# EAGLE design MIDIWidgetRevB (EAGLE 6.5.0)
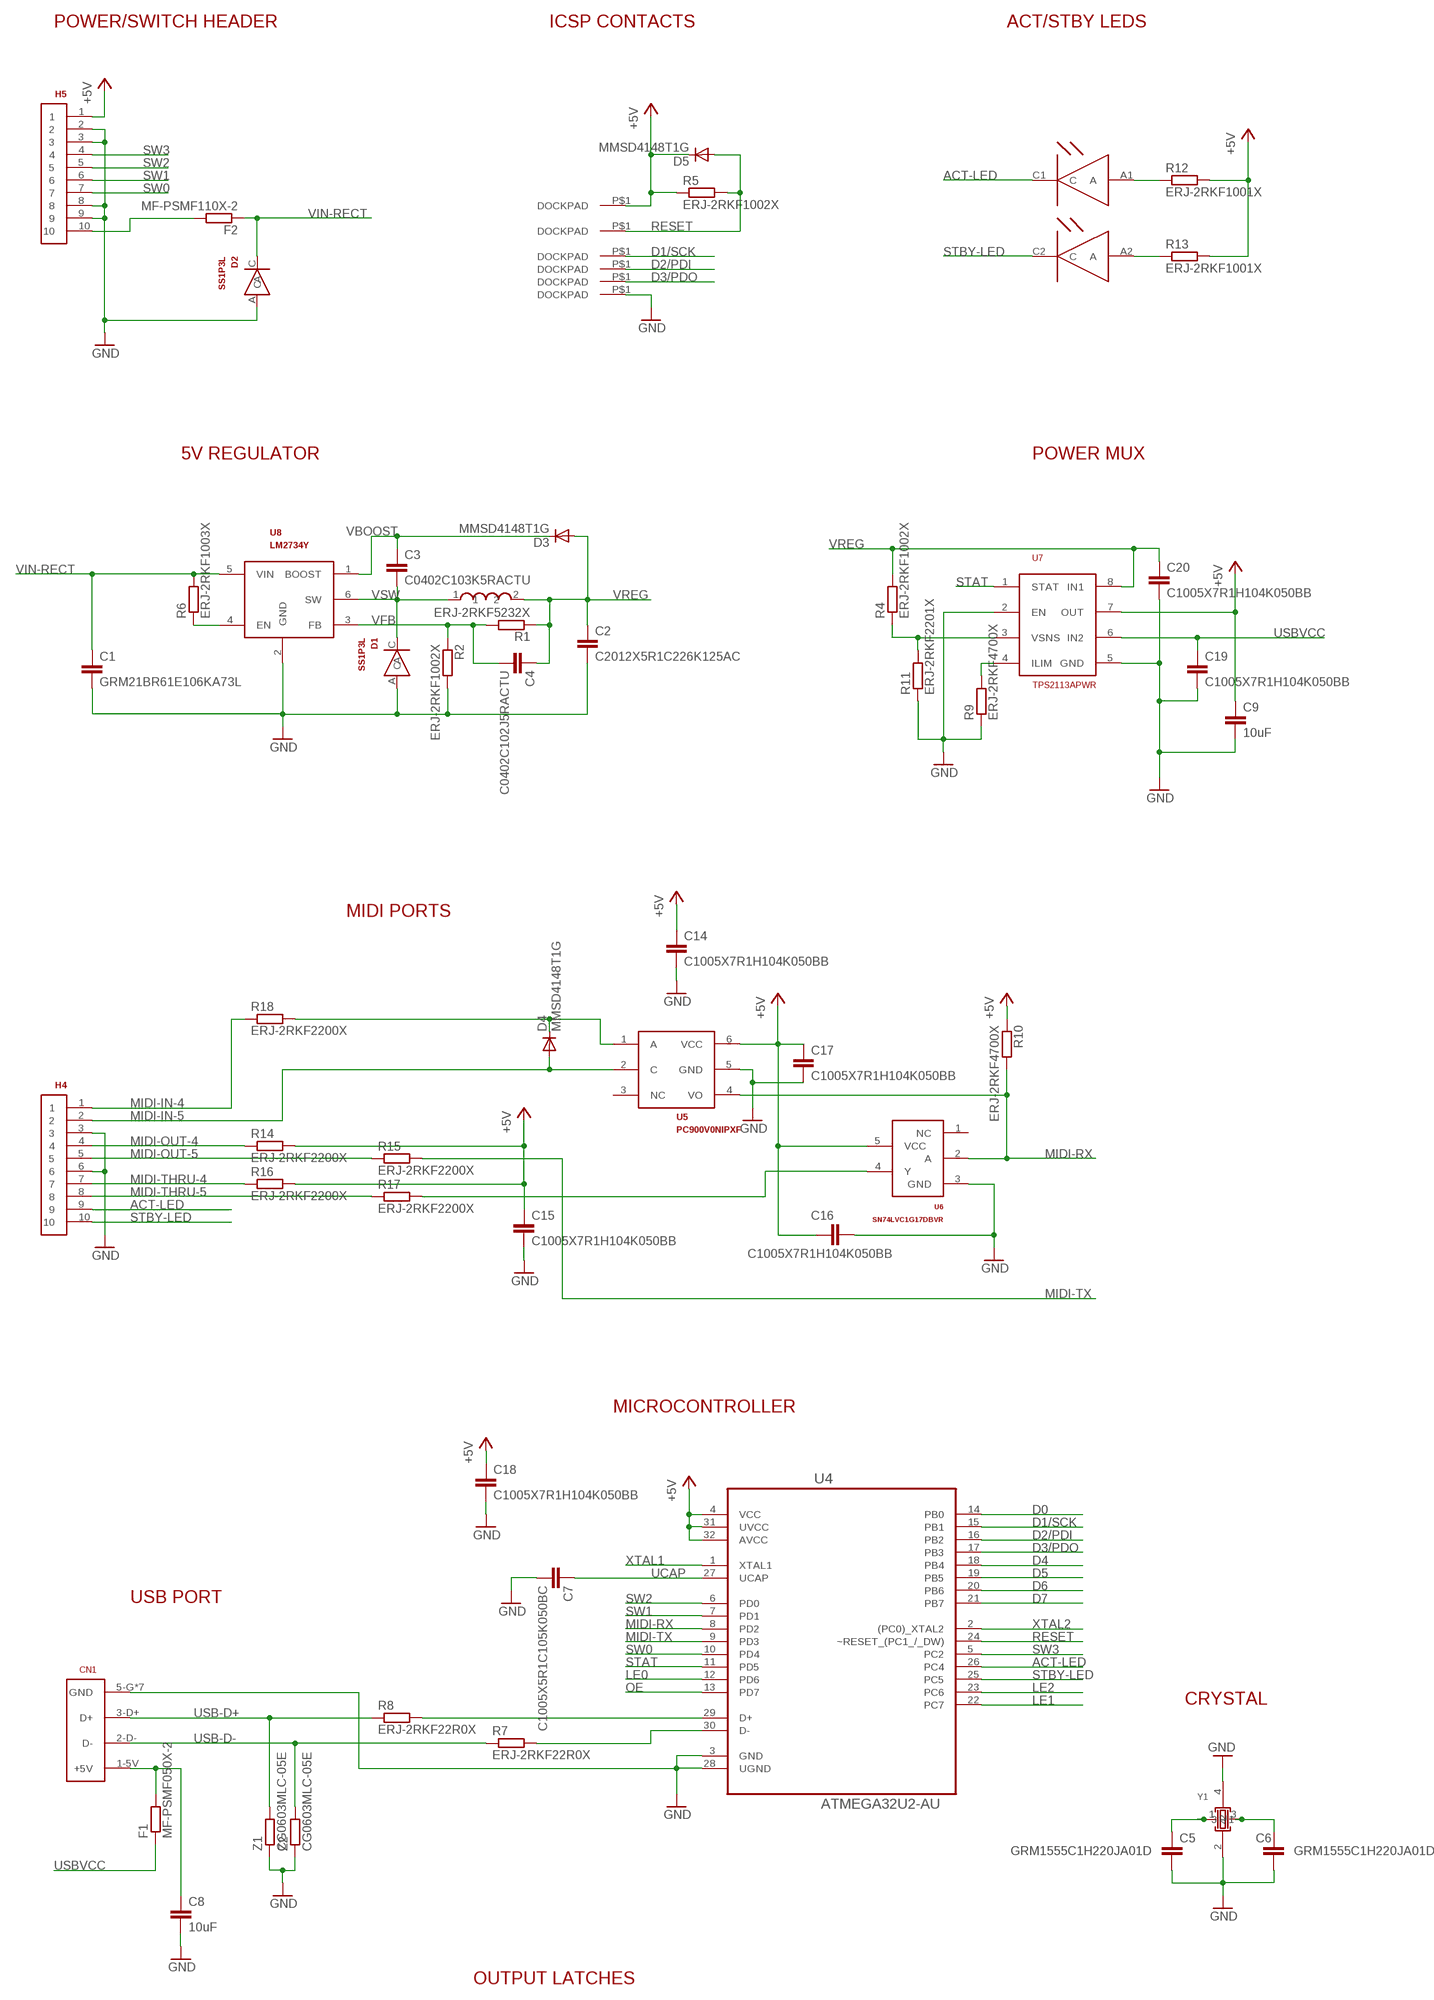
[diagram p0: schematic, sheet 1, part 1 of 2]
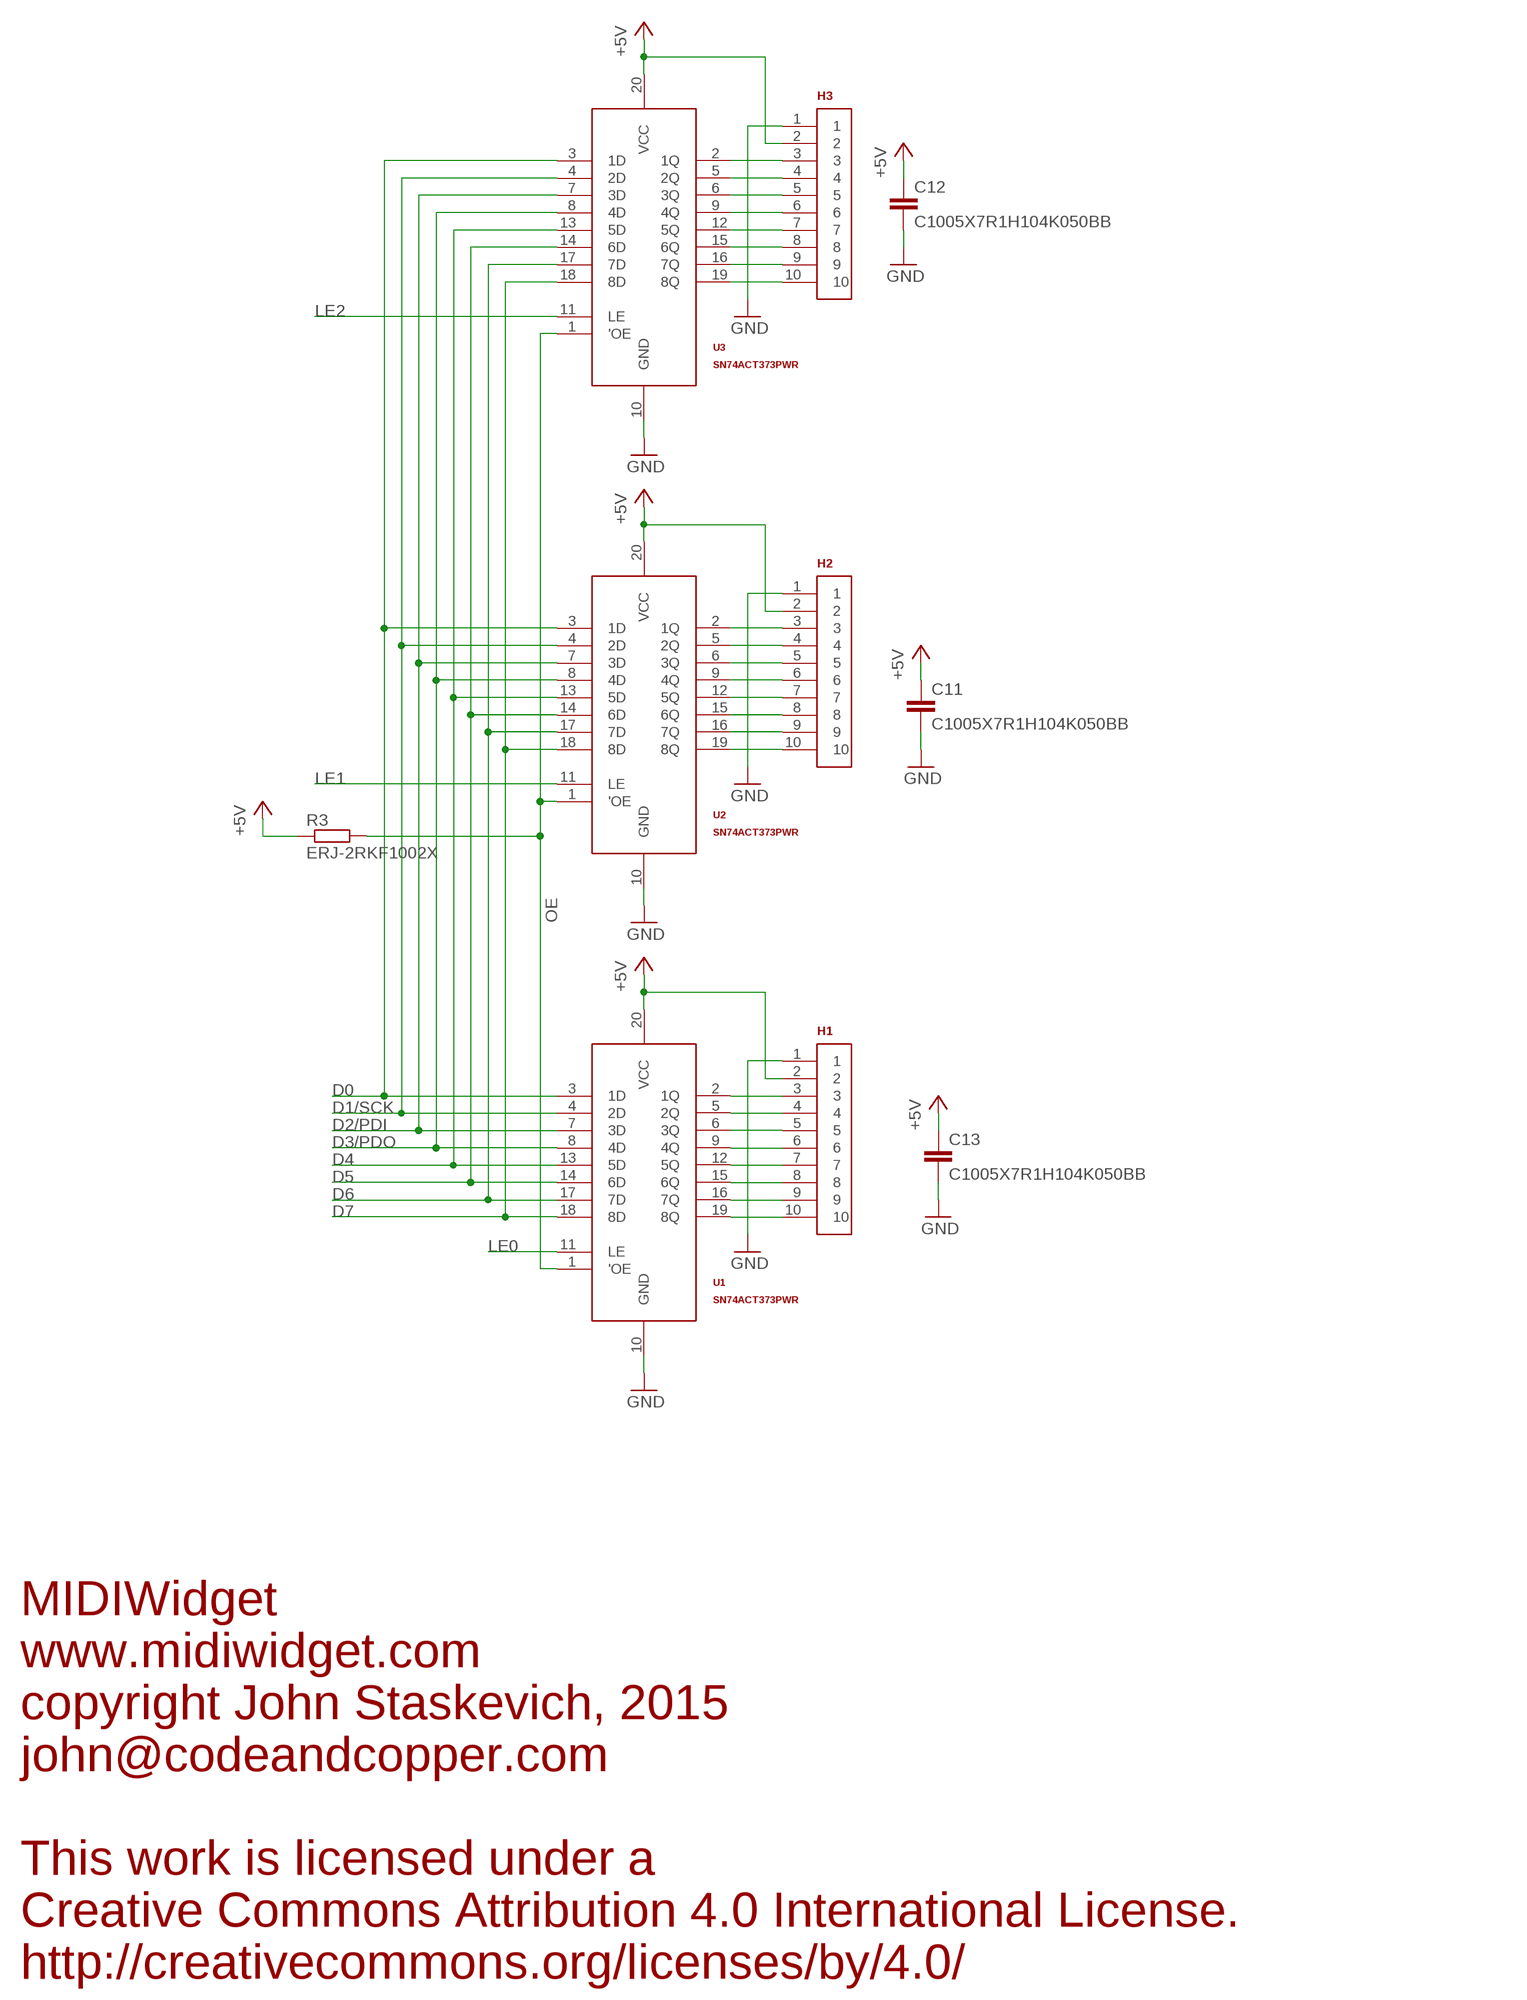
[diagram p1: schematic, sheet 1, part 2 of 2]

## Parts
C1  GRM21BR61E106KA73L  C-EUC0805  [C0805]
C2  C2012X5R1C226K125AC  C-EUC0805  [C0805]
C3  C0402C103K5RACTU  C-EUC0402  [C0402]
C4  C0402C102J5RACTU  C-EUC0402  [C0402]
C5  GRM1555C1H220JA01D  C-EUC0402  [C0402]
C6  GRM1555C1H220JA01D  C-EUC0402  [C0402]
C7  C1005X5R1C105K050BC  C-EUC0402  [C0402]
C8  10uF  C-EUC0805  [C0805]
C9  10uF  C-EUC0805  [C0805]
C11  C1005X7R1H104K050BB  C-EUC0402  [C0402]
C12  C1005X7R1H104K050BB  C-EUC0402  [C0402]
C13  C1005X7R1H104K050BB  C-EUC0402  [C0402]
C14  C1005X7R1H104K050BB  C-EUC0402  [C0402]
C15  C1005X7R1H104K050BB  C-EUC0402  [C0402]
C16  C1005X7R1H104K050BB  C-EUC0402  [C0402]
C17  C1005X7R1H104K050BB  C-EUC0402  [C0402]
C18  C1005X7R1H104K050BB  C-EUC0402  [C0402]
C19  C1005X7R1H104K050BB  C-EUC0402  [C0402]
C20  C1005X7R1H104K050BB  C-EUC0402  [C0402]
CN1  10118192-0001LF  USB-B  [USB-MICRO-B]
D1  SS1P3L  DIODE  [DO-220AA(SMP)]
D2  SS1P3L  DIODE  [DO-220AA(SMP)]
D3  MMSD4148T1G  1N4148SOD123  [SOD123]
D4  MMSD4148T1G  1N4148SOD123  [SOD123]
D5  MMSD4148T1G  1N4148SOD123  [SOD123]
DOCK-GND  DOCKPAD  [DOCKPAD-ROUND-2.0MM]
DOCK-PDI  DOCKPAD  [DOCKPAD-ROUND-2.0MM]
DOCK-PDO  DOCKPAD  [DOCKPAD-ROUND-2.0MM]
DOCK-RESET  DOCKPAD  [DOCKPAD-ROUND-2.0MM]
DOCK-SCK  DOCKPAD  [DOCKPAD-ROUND-2.0MM]
DOCK-VCC  DOCKPAD  [DOCKPAD-ROUND-2.0MM]
F1  MF-PSMF050X-2  R-EU_R0805  [R0805]
F2  MF-PSMF110X-2  R-EU_R0805  [R0805]
H1  TERMINAL-BLOCK-10POS  [TB-2-54-10POS]
H2  TERMINAL-BLOCK-10POS  [TB-2-54-10POS]
H3  TERMINAL-BLOCK-10POS  [TB-2-54-10POS]
H4  TERMINAL-BLOCK-10POS  [TB-2-54-10POS]
H5  TERMINAL-BLOCK-10POS  [TB-2-54-10POS]
L1  SLF7055T-220M1R7-3PF  INDUCTOR-SMT  [SLF7055]
LED  HSMF-C155  DUAL-LED  [LUMEX-1210-DUAL-LED]
R1  ERJ-2RKF5232X  R-EU_R0402  [R0402]
R2  ERJ-2RKF1002X  R-EU_R0402  [R0402]
R3  ERJ-2RKF1002X  R-EU_R0402  [R0402]
R4  ERJ-2RKF1002X  R-EU_R0402  [R0402]
R5  ERJ-2RKF1002X  R-EU_R0402  [R0402]
R6  ERJ-2RKF1003X  R-EU_R0402  [R0402]
R7  ERJ-2RKF22R0X  R-EU_R0402  [R0402]
R8  ERJ-2RKF22R0X  R-EU_R0402  [R0402]
R9  ERJ-2RKF4700X  R-EU_R0402  [R0402]
R10  ERJ-2RKF4700X  R-EU_R0402  [R0402]
R11  ERJ-2RKF2201X  R-EU_R0402  [R0402]
R12  ERJ-2RKF1001X  R-EU_R0402  [R0402]
R13  ERJ-2RKF1001X  R-EU_R0402  [R0402]
R14  ERJ-2RKF2200X  R-EU_R0402  [R0402]
R15  ERJ-2RKF2200X  R-EU_R0402  [R0402]
R16  ERJ-2RKF2200X  R-EU_R0402  [R0402]
R17  ERJ-2RKF2200X  R-EU_R0402  [R0402]
R18  ERJ-2RKF2200X  R-EU_R0402  [R0402]
U1  SN74ACT373PWR  74ABT373  [TSSOP-20]
U2  SN74ACT373PWR  74ABT373  [TSSOP-20]
U3  SN74ACT373PWR  74ABT373  [TSSOP-20]
U4  ATMEGA32U2-AU  [QFP80P900X900X120-32N]
U5  PC900V0NIPXF  PC900V  [SMT-6]
U6  SN74LVC1G17DBVR  SN74LVC1G17  [SOT23-5-GOOD]
U7  TPS2113APWR  TPS2112NAKED  [TSSOP-8-NAKED]
U8  LM2734Y  LM2734  [TSOT-6]
Y1  403C35E16M00000  CTS-403-CRYSTAL  [CRYSTAL-32-25MM]
Z1  CG0603MLC-05E  R-EU_R0603  [R0603]
Z2  CG0603MLC-05E  R-EU_R0603  [R0603]

## Nets
+5V [power]: C9.1 C11.1 C12.1 C13.1 C14.1 C15.1 C16.1 C17.1 C18.1 D5.C DOCK-VCC.P$1(DOCKPAD) H1.2 H2.2 H3.2 H5.1 R3.1 R5.1 R10.1 R12.2 R13.2 R14.2 R16.2 U1.20(VCC) U2.20(VCC) U3.20(VCC) U4.4(VCC) U4.31(UVCC) U4.32(AVCC) U5.6(VCC) U6.5(VCC) U7.7(OUT)
ACT-LED: H4.9 LED.C1(C) U4.26(PC4)
D0: U1.3(1D) U2.3(1D) U3.3(1D) U4.14(PB0)
D1/SCK: DOCK-SCK.P$1(DOCKPAD) U1.4(2D) U2.4(2D) U3.4(2D) U4.15(PB1)
D2/PDI: DOCK-PDI.P$1(DOCKPAD) U1.7(3D) U2.7(3D) U3.7(3D) U4.16(PB2)
D3/PDO: DOCK-PDO.P$1(DOCKPAD) U1.8(4D) U2.8(4D) U3.8(4D) U4.17(PB3)
D4: U1.13(5D) U2.13(5D) U3.13(5D) U4.18(PB4)
D5: U1.14(6D) U2.14(6D) U3.14(6D) U4.19(PB5)
D6: U1.17(7D) U2.17(7D) U3.17(7D) U4.20(PB6)
D7: U1.18(8D) U2.18(8D) U3.18(8D) U4.21(PB7)
EN: R6.1 U8.4(EN)
GND [power]: C1.2 C2.2 C5.2 C6.2 C7.2 C8.2 C9.2 C11.2 C12.2 C13.2 C14.2 C15.2 C16.2 C17.2 C18.2 C19.2 C20.2 CN1.5-G(GND) CN1.P$1(GND) CN1.P$2(GND) CN1.P$3(GND) CN1.P$4(GND) CN1.P$10(GND) CN1.P$11(GND) D1.A D2.A DOCK-GND.P$1(DOCKPAD) H1.1 H2.1 H3.1 H4.3 H4.6 H5.2 H5.3 H5.8 H5.9 R2.2 R9.1 R11.1 U1.10(GND) U2.10(GND) U3.10(GND) U4.3(GND) U4.28(UGND) U5.5(GND) U6.3(GND) U7.2(EN) U7.5(GND) U8.2(GND) Y1.2 Y1.4 Z1.1 Z2.1
ILIM: R9.2 U7.4(ILIM)
LE0: U1.11(LE) U4.12(PD6)
LE1: U2.11(LE) U4.22(PC7)
LE2: U3.11(LE) U4.23(PC6)
MIDI-IN-4: H4.1 R18.1
MIDI-IN-5: D4.A H4.2 U5.2(C)
MIDI-OUT-4: H4.4 R14.1
MIDI-OUT-5: H4.5 R15.1
MIDI-RX: R10.2 U4.8(PD2) U5.4(VO) U6.2(A)
MIDI-THRU-4: H4.7 R16.1
MIDI-THRU-5: H4.8 R17.1
MIDI-TX: R15.2 U4.9(PD3)
N$1: H1.10 U1.19(8Q)
N$2: H1.9 U1.16(7Q)
N$3: H1.8 U1.15(6Q)
N$4: H1.7 U1.12(5Q)
N$5: H1.6 U1.9(4Q)
N$6: H1.5 U1.6(3Q)
N$7: H1.4 U1.5(2Q)
N$8: H1.3 U1.2(1Q)
N$9: H2.3 U2.2(1Q)
N$10: H2.4 U2.5(2Q)
N$11: H2.5 U2.6(3Q)
N$12: H2.6 U2.9(4Q)
N$13: H2.7 U2.12(5Q)
N$14: H2.8 U2.15(6Q)
N$15: H2.9 U2.16(7Q)
N$16: H2.10 U2.19(8Q)
N$17: H3.9 U3.16(7Q)
N$18: H3.10 U3.19(8Q)
N$19: H3.8 U3.15(6Q)
N$20: H3.7 U3.12(5Q)
N$21: H3.6 U3.9(4Q)
N$22: H3.5 U3.6(3Q)
N$23: H3.4 U3.5(2Q)
N$24: H3.3 U3.2(1Q)
N$25: D4.C R18.2 U5.1(A)
N$26: LED.A1(A) R12.1
N$27: LED.A2(A) R13.1
N$28: F2.2 H5.10
N$30: C8.1 CN1.1-5V(+5V) F1.2
N$33: R17.2 U6.4(Y)
OE: R3.2 U1.1('OE) U2.1('OE) U3.1('OE) U4.13(PD7)
RESET: D5.A DOCK-RESET.P$1(DOCKPAD) R5.2 U4.24(~RESET_(PC1_/_DW))
STAT: U4.11(PD5) U7.1(STAT)
STBY-LED: H4.10 LED.C2(C) U4.25(PC5)
SW0: H5.7 U4.10(PD4)
SW1: H5.6 U4.7(PD1)
SW2: H5.5 U4.6(PD0)
SW3: H5.4 U4.5(PC2)
UCAP: C7.1 U4.27(UCAP)
USB-D+: CN1.3-D+(D+) R8.1 Z1.2
USB-D+R: R8.2 U4.29(D+)
USB-D-: CN1.2-D-(D-) R7.1 Z2.2
USB-D-R: R7.2 U4.30(D-)
USBVCC [power]: C19.1 F1.1 U7.6(IN2)
VBOOST: C3.1 D3.C U8.1(BOOST)
VFB: C4.2 R1.2 R2.1 U8.3(FB)
VIN-RECT: C1.1 D2.C F2.1 R6.2 U8.5(VIN)
VREG: C2.1 C4.1 C20.1 D3.A L1.2 R1.1 R4.2 U7.8(IN1)
VSNS: R4.1 R11.2 U7.3(VSNS)
VSW [power]: C3.2 D1.C L1.1 U8.6(SW)
XTAL1: C5.1 U4.1(XTAL1) Y1.1
XTAL2: C6.1 U4.2((PC0)_XTAL2) Y1.3
Unconnected: U5.3(NC) U6.1(NC)

## Notes on the sheet
- POWER/SWITCH HEADER | ICSP CONTACTS | ACT/STBY LEDS
- 5V REGULATOR | POWER MUX
- MIDI PORTS
- MICROCONTROLLER
- USB PORT
- CRYSTAL
- OUTPUT LATCHES
- MIDIWidget
  www.midiwidget.com
  copyright John Staskevich, 2015
  john@codeandcopper.com
  
  This work is licensed under a
  Creative Commons Attribution 4.0 International License.
  http://creativecommons.org/licenses/by/4.0/

## Library data of the parts
C1-C9 C11-C20 = rcl:C-EU: CAPACITOR, European symbol
CN1 = MDU24:USB-B
D1 D2 = 0jrs:DIODE
D3-D5 = diode:1N4148: DIODE high speed (Philips)
DOCK-GND DOCK-PDI DOCK-PDO DOCK-RESET DOCK-SCK DOCK-VCC = 0jrs:DOCKPAD
F1 F2 R1-R18 Z1 Z2 = rcl:R-EU_: RESISTOR, European symbol
H1-H5 = 0jrs:TERMINAL-BLOCK-10POS
L1 = 0jrs:INDUCTOR-SMT
LED = 0jrs:DUAL-LED
U1-U3 = MDU24:74ABT373
U4 = Atmel_By_element14_Batch_1:ATMEGA32U2-AU: 8-bit Microcontroller with ISP Flash and USB Controller; MPN: ATMEGA32U2-AU; OC_FARNELL: 1748524; OC_NEWARK: 26R5632; PACKAGE: TQFP-32; SUPPLIER: Atmel
U5 = 0jrs:PC900V
U6 = 0jrs:SN74LVC1G17
U7 = EG:TPS2112
U8 = 0jrs:LM2734
Y1 = EG:CTS-403-CRYSTAL

## Net classes
0 default: width 0.203 mm, drill 0.406 mm, clearance 0.203 mm
1 power: width 0.254 mm, drill 0.406 mm, clearance 0.229 mm

## Board
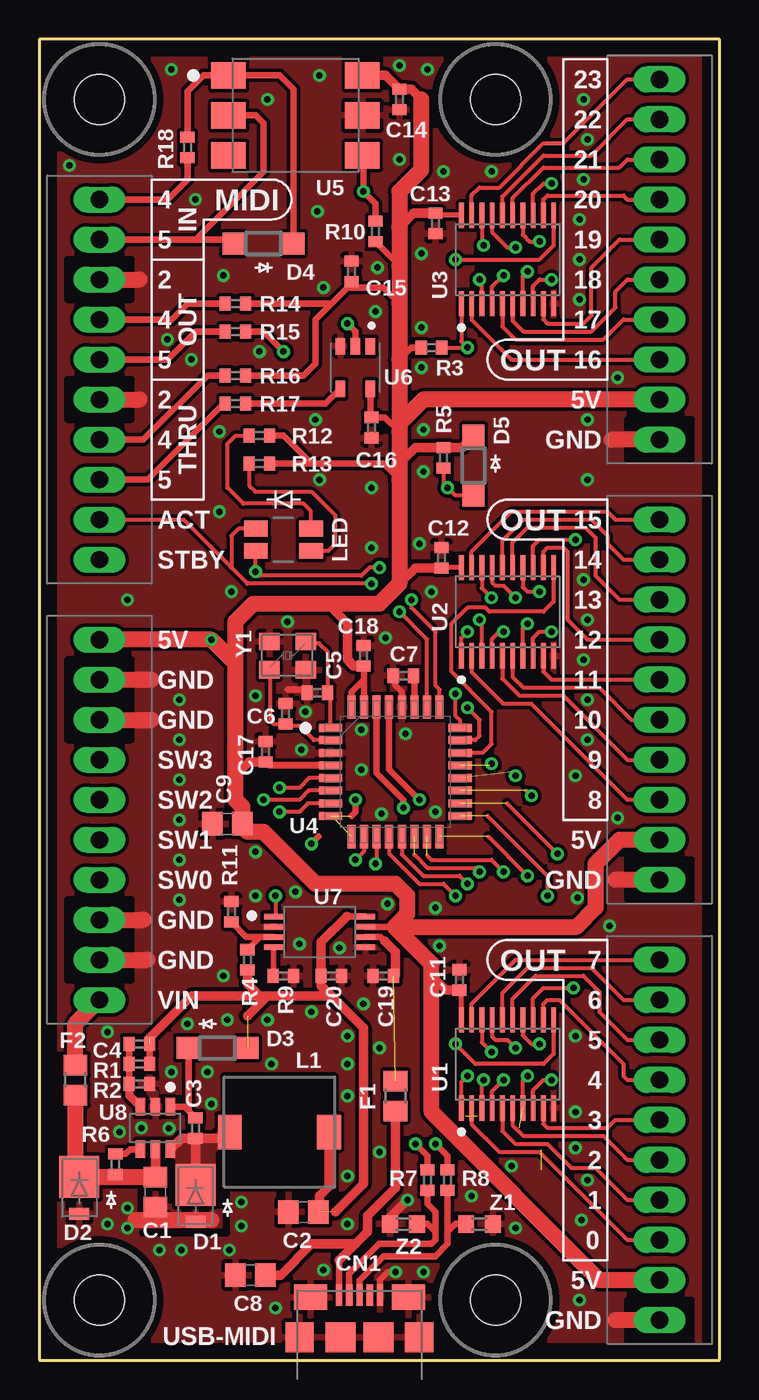
[diagram p2: board, top side]
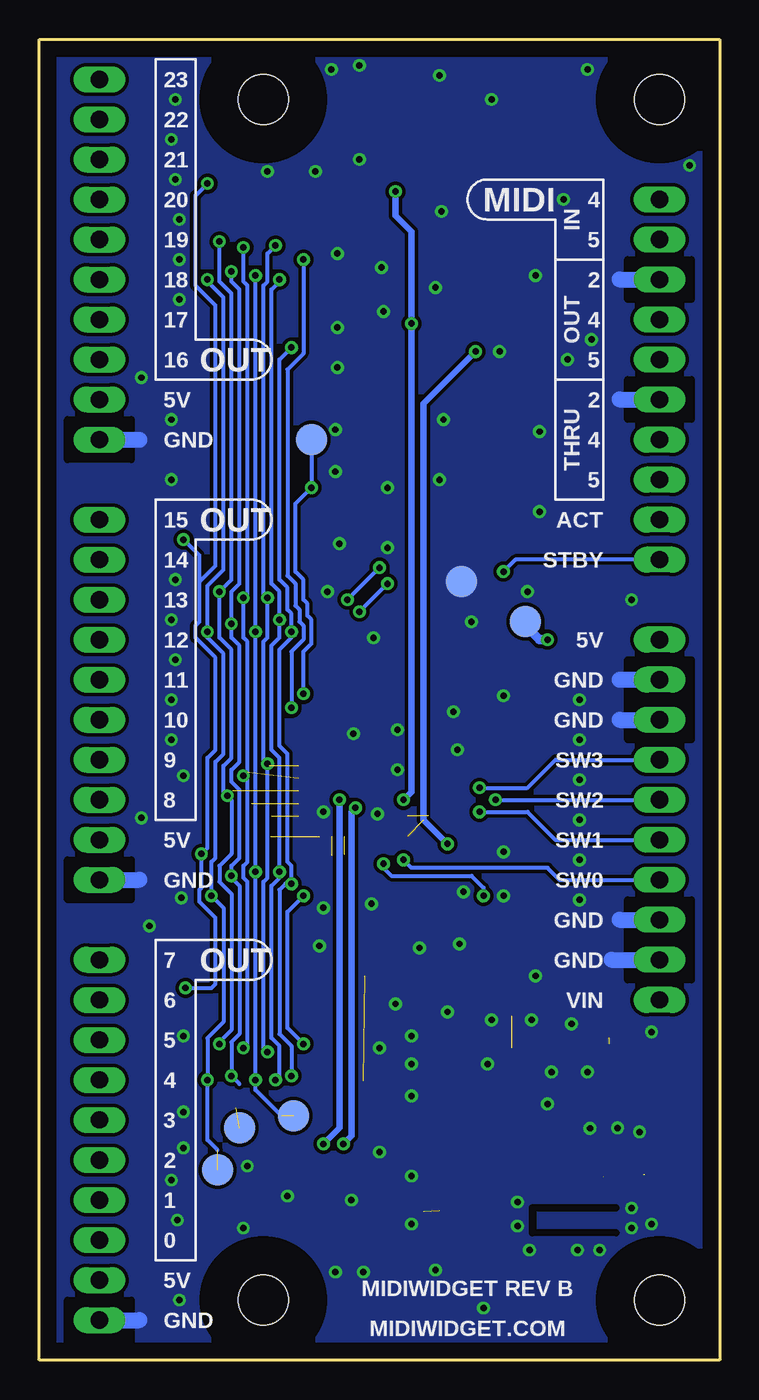
[diagram p3: board, bottom side, seen from below]

Size 43.18 x 83.82 mm. Coordinates in mm from the lower left corner, seen from the top.
Outline: 0,0 43.18,0 43.18,83.82 0,83.82 0,0
Copper layers (1*16): Top 0.035mm / dielectric 1.5mm / Bottom 0.035mm
Design rules "default *": minimum track width 8mil, minimum drill 16mil, track to track 8mil, track to pad 8mil, pad to pad 8mil, via to via 8mil, smd to smd 8mil, copper to edge 40mil, drill to drill 8mil, minimum pad ring 10mil, minimum via ring 8mil, stop-mask expansion 4mil, vias tented up to drill 0mil, thermal gap 10mil
Holes 3.17 mm at 28.96,3.81 28.96,80.01 3.81,3.81 3.81,80.01
tRestrict: area 0,76.2 to 7.6,83.8; area 25.1,76.2 to 32.8,83.8; area 25.1,0 to 32.8,7.6; area 0,0 to 7.6,7.6; area 11.7,10.9 to 18.8,18; area 18,2.5 to 22.6,2.8; area 22.1,3.8 to 22.4,4.3; area 25.1,1 to 25.4,1.5; area 6.6,8.1 to 11.9,8.1; area 11.9,8.1 to 11.9,10.9; area 11.9,10.9 to 11.9,13.7; area 6.4,9.4 to 6.5,10.5; 9 more areas
bRestrict: area 0,0 to 7.6,7.6; area 25.1,0 to 32.8,7.6; area 25.1,76.2 to 32.8,83.8; area 0,76.2 to 7.6,83.8; area 37.3,57.2 to 41.4,59.7; area 37.3,29.2 to 41.4,31.8; area 37.3,1.3 to 41.4,3.8; area 1.8,41.9 to 5.8,44.5; area 1.8,26.7 to 5.8,29.2; area 6.6,8.1 to 11.9,8.1; area 6.6,9.7 to 11.9,9.7; area 11.9,8.1 to 11.9,9.7; 4 more areas

### Footprints (pad centres in the part's own frame; a part is rotated, then mirrored left to right if it is on the bottom)
C0805 = smd 1.3 x 1.5: 1 -0.95,0; 2 0.95,0
C0402 = smd 0.7 x 0.9: 1 -0.65,0; 2 0.65,0
USB-MICRO-B = smd 0.4 x 1.35: 1-5V 1.3,-2.675; 2-D- 0.65,-2.675; 3-D+ 0,-2.675; 4-NC -0.65,-2.675; 5-G -1.3,-2.675 | smd 1.8 x 1.9: P$1 -3.8,0; P$4 3.8,0 | smd 1.9 x 1.9: P$2 -1.2,0; P$3 1.2,0 | smd 2.1 x 1.6: P$10 -3.1,-2.55; P$11 3.1,-2.55
DO-220AA(SMP) = smd 0.762 x 1.27: A 1.653,0 | smd 2.67 x 2.54: C -0.699,0
SOD123 = smd 1.4 x 1.4: A 1.9,0; C -1.9,0
DOCKPAD-ROUND-2.0MM = smd 2 x 2: P$1 0,0
R0805 = smd 1.3 x 1.5: 1 -0.95,0; 2 0.95,0
TB-2-54-10POS = drill 1.092 long: 1 -11.43,0; 2 -8.89,0; 3 -6.35,0; 4 -3.81,0; 5 -1.27,0; 6 1.27,0; 7 3.81,0; 8 6.35,0; 9 8.89,0; 10 11.43,0
SLF7055 = smd 1.5 x 2.2: 1 -3.15,0; 2 3.15,0
LUMEX-1210-DUAL-LED = smd 1.5 x 1: A1 1.75,0.7; A2 1.75,-0.7; C1 -1.75,0.7; C2 -1.75,-0.7
R0402 = smd 0.7 x 0.9: 1 -0.65,0; 2 0.65,0
TSSOP-20 = smd 0.3 x 1.6: 1 -2.925,-2.8; 2 -2.275,-2.8; 3 -1.625,-2.8; 4 -0.975,-2.8; 5 -0.325,-2.8; 6 0.325,-2.8; 7 0.975,-2.8; 8 1.625,-2.8; 9 2.275,-2.8; 10 2.925,-2.8; 11 2.925,2.8; 12 2.275,2.8; 13 1.625,2.8; 14 0.975,2.8; 15 0.325,2.8; 16 -0.325,2.8; 17 -0.975,2.8; 18 -1.625,2.8; 19 -2.275,2.8; 20 -2.925,2.8
QFP80P900X900X120-32N = smd 1.473 x 0.508: 1 -4.115,2.794; 2 -4.115,2.007; 3 -4.115,1.194; 4 -4.115,0.406; 5 -4.115,-0.406; 6 -4.115,-1.194; 7 -4.115,-2.007; 8 -4.115,-2.794; 17 4.115,-2.794; 18 4.115,-2.007; 19 4.115,-1.194; 20 4.115,-0.406; 21 4.115,0.406; 22 4.115,1.194; 23 4.115,2.007; 24 4.115,2.794 | smd 0.508 x 1.473: 9 -2.794,-4.115; 10 -2.007,-4.115; 11 -1.194,-4.115; 12 -0.406,-4.115; 13 0.406,-4.115; 14 1.194,-4.115; 15 2.007,-4.115; 16 2.794,-4.115; 25 2.794,4.115; 26 2.007,4.115; 27 1.194,4.115; 28 0.406,4.115; 29 -0.406,4.115; 30 -1.194,4.115; 31 -2.007,4.115; 32 -2.794,4.115
SMT-6 = smd 2.2 x 1.7: 1 -4.25,2.54; 2 -4.25,0; 3 -4.25,-2.54; 4 4.25,-2.54; 5 4.25,0; 6 4.25,2.54
SOT23-5-GOOD = smd 1.05 x 0.6: 1 -1.35,0.95; 2 -1.35,0; 3 -1.35,-0.95; 4 1.35,-0.95; 5 1.35,0.95
TSSOP-8-NAKED = smd 1.2 x 0.35: 1 -2.925,0.975; 2 -2.925,0.325; 3 -2.925,-0.325; 4 -2.925,-0.975; 5 2.925,-0.975; 6 2.925,-0.325; 7 2.925,0.325; 8 2.925,0.975
TSOT-6 = smd 0.6 x 1.1: 1 -0.95,-1.35; 2 0,-1.35; 3 0.95,-1.35; 4 0.95,1.35; 5 0,1.35; 6 -0.95,1.35
CRYSTAL-32-25MM = smd 1.3 x 1.1: 1 -1.15,-0.9; 2 1.15,-0.9; 3 1.15,0.9; 4 -1.15,0.9
R0603 = smd 1 x 1.1: 1 -0.85,0; 2 0.85,0

### Placement (x,y rotation side)
C1  7.37,10.67 270 top
C2  16.76,9.4 180 top
C3  9.91,14.73 270 top
C4  6.35,20.07 180 top
C5  17.65,42.35 180 top
C6  15.62,41.02 90 top
C7  23.11,43.43 180 top
C8  13.4,5.4 180 top
C9  11.94,34.04 180 top
C11  26.67,24.13 90 top
C12  25.53,50.93 90 top
C13  25.15,72.14 270 top
C14  22.86,80.01 270 top
C15  19.81,69.09 90 top
C16  21.08,59.18 270 top
C17  14.35,38.61 90 top
C18  20.57,44.7 90 top
C19  21.84,24.38 180 top
C20  18.54,24.38 0 top
CN1  20.32,1.45 180 top
D1  9.91,10.41 270 top
D2  2.54,10.92 270 top
D3  11.3,19.81 0 top
D4  14.22,70.87 180 top
D5  27.56,56.77 270 top
DOCK-GND  16.38,49.4 0 bottom
DOCK-PDI  30.48,14.73 0 bottom
DOCK-PDO  31.88,12.06 0 bottom
DOCK-RESET  25.91,58.42 0 bottom
DOCK-SCK  27.05,15.49 0 bottom
DOCK-VCC  12.32,46.86 0 bottom
F1  22.61,16.76 270 top
F2  2.29,17.78 90 top
H1  39.37,13.97 90 top
H2  39.37,41.91 90 top
H3  39.37,69.85 90 top
H4  3.81,62.23 270 top
H5  3.81,34.29 270 top
L1  15.24,14.48 0 top
LED  15.49,52.07 0 top
R1  6.35,18.8 180 top
R2  6.35,17.53 0 top
R3  24.89,64.26 0 top
R4  13.21,25.4 270 top
R5  25.65,57.28 270 top
R6  4.83,12.45 270 top
R7  24.64,11.43 90 top
R8  25.91,11.43 90 top
R9  15.49,24.38 180 top
R10  21.34,71.63 90 top
R11  12.19,28.45 270 top
R12  13.97,58.67 0 top
R13  13.97,56.9 0 top
R14  12.45,67.06 0 top
R15  12.45,65.28 0 top
R16  12.45,62.48 0 top
R17  12.45,60.71 0 top
R18  9.4,76.96 90 top
U1  29.72,18.8 0 top
U2  29.72,47.5 0 top
U3  29.72,69.85 0 top
U4  22.61,37.34 0 top
U5  16.26,78.99 0 top
U6  20.07,62.99 270 top
U7  17.78,27.18 0 top
U8  7.37,14.73 180 top
Y1  15.75,44.7 180 top
Z1  27.94,8.64 180 top
Z2  23.11,8.64 0 top

### Tracks (layer width: path | path; a pad name or v marks a point on that pad's centre or on a via)
+5V  (via drill 0.41)
  Top 0.254: C15.1 19.81,68.07
  Top 0.305: U1.20 26.79,23.36 C11.1 | U3.20 25.28,72.65 C13.1 | U2.20 25.55,50.3
  Top 0.406: R10.1 22.86,69.45 | R13.2 17.27,56.9 | 17.27,56.9 21.84,56.9 22.86,55.88 | R12.2 15.49,58.67 17.27,56.9 | 18.54,67.06 19.56,68.07 19.81,68.07 21.84,68.07 22.86,67.06 | R3.1 23.62,64.26 22.86,63.5 | U7.7 22.55,27.5 | 22.86,58.93 21.96,59.83 C16.1 21.02,59.9 U6.5 | R14.2 18.54,67.06 | 18.54,67.06 17.53,66.04 17.53,63.25 16.76,62.48 R16.2 | U4.31 20.6,43.18 | 20.6,43.18 20.6,44.03 C18.1 | U4.32 19.81,42.39 20.6,43.18 | 25.55,50.3 C12.1
  Top 0.457: U4.4 14.56,37.74 C17.1
  Top 0.61: C17.1 13.32,37.96 12.45,37.08 | 24.26,80.01 23.61,80.66 C14.1 21.99,81.53 U5.6 | C11.1 25.8,23.48 24.89,24.38 | C13.1 23.76,72.79 22.86,71.88 | C18.1 19.95,44.05 19.56,44.45 19.56,46.74 18.29,48.01 | C12.1 23.86,50.28 22.86,49.28 | 22.86,56.9 23.89,57.93 R5.1 26.82,57.93 D5.C
  Top 1.016: H1.2 35.56,5.08 24.89,15.75 24.89,24.38 24.89,25.16 22.55,27.5 | 22.86,59.44 22.86,63.5 22.86,67.06 22.86,69.45 22.86,71.88 22.86,74.17 24.26,75.56 24.26,80.01 | 22.86,59.44 22.86,58.93 22.86,56.9 22.86,55.88 22.86,49.28 21.59,48.01 18.29,48.01 13.59,48.01 12.45,46.86 12.45,44.2 | H2.2 36.83,33.02 35.31,31.5 35.31,28.7 34.11,27.5 22.55,27.5 | H3.2 24.38,60.96 22.86,59.44 | 12.45,44.2 v10.92,45.72 H5.1 | 22.55,27.5 23.37,28.32 23.37,29.46 22.61,30.23 17.53,30.23 14.22,33.53 13.21,33.53 13.21,33.72 C9.1 12.89,35.12 12.45,35.56 12.45,37.08 12.45,44.2
  Bottom 0.61: DOCK-VCC.P$1 12.45,46.74 11.43,45.72 v10.92,45.72
ACT-LED  (via drill 0.41)
  Top 0.254: U4.26 24.61,45.74 v22.86,47.5 | v21.08,49.28 13.21,49.28 12.19,50.29 | 12.19,50.29 9.14,53.34 H4.9 | LED.C1 12.64,52.77 12.19,52.32 12.19,50.29
  Bottom 0.254: v22.86,47.5 v21.08,49.28
D0  (via drill 0.41)  (1 unrouted)
  Top 0.254: U1.3 28.09,17.68 v28.19,17.78 | U2.3 28.09,46.84 v27.94,46.99 | U3.3 28.09,68.43 v27.94,68.58 | 23.8,32.08 24.64,31.24 27.69,31.24 v27.94,30.99
  Bottom 0.254: v28.19,17.78 27.94,18.03 27.94,19.94 28.45,20.45 28.45,30.1 27.94,30.61 v27.94,30.99 27.94,38.23 28.45,38.73 28.45,45.34 27.94,45.85 v27.94,46.99 27.94,48.77 28.45,49.28 28.45,67.94 27.94,68.45 v27.94,68.58
D1/SCK  (via drill 0.41)  (2 unrouted)
  Top 0.254: U1.4 28.74,17.06 v29.46,17.78 | U2.4 28.74,45.76 29.21,46.23 v29.46,46.23 | U3.4 28.74,68.11 v29.46,68.83 | 24.61,32.03 24.89,31.75 28.7,31.75 v29.46,30.99
  Bottom 0.254: v29.46,68.83 v29.46,46.23 v29.46,30.99 v29.46,17.78 29.46,17.14 27.81,15.49
D2/PDI  (via drill 0.41)  (2 unrouted)
  Top 0.254: U1.7 30.69,17.74 v30.99,18.03 | U2.7 30.69,46.44 v30.99,46.74 | U3.7 30.69,68.79 v30.99,69.09 | 28.5,33.22 v30.99,30.73
  Bottom 0.254: v30.99,69.09 30.99,68.45 30.48,67.94 30.48,49.28 30.99,48.77 v30.99,46.74 30.99,45.85 30.48,45.34 30.48,37.97 30.99,37.47 30.99,36.7 30.48,36.2 30.48,31.88 30.99,31.37 v30.99,30.73 30.99,30.61 30.48,30.1 30.48,20.7 30.99,20.19 v30.99,18.03 30.48,17.53
D3/PDO  (via drill 0.41)  (2 unrouted)
  Top 0.254: U1.8 31.34,17.12 32,17.78 v32.51,17.78 | U2.8 31.34,45.82 31.75,46.23 v32.51,46.23 | U3.8 31.34,68.17 31.75,68.58 v32.51,68.58 | v32.26,29.46 32.26,30.73 28.45,34.54
  Bottom 0.254: v32.51,68.58 32.51,68.45 31.5,67.44 31.5,50.16 32.51,49.15 v32.51,46.23 32.51,45.85 31.5,44.83 31.5,38.48 32,37.97 32,31.88 32.26,31.62 v32.26,29.46 31.5,28.7 31.5,21.46 32.51,20.45 v32.51,17.78 32.51,13.97 31.88,13.34
D4  (via drill 0.41)  (1 unrouted)
  Top 0.254: U1.13 31.34,22.96 32,23.62 v33.91,23.62 | U3.13 31.34,74.02 32,74.68 v32.51,74.68 | U2.13 31.34,51.66 31.75,52.07 v34.04,52.07 | 29.69,35.33 v32.89,32.13
  Bottom 0.254: v33.91,23.62 32.26,23.62 32,23.88 32,28.07 33.02,29.08 33.02,29.84 32.89,29.97 v32.89,32.13 32.51,32.51 32.51,38.23 32,38.73 32,44.58 33.27,45.85 33.27,46.61 33.02,46.86 33.02,49.4 | 33.02,49.4 33.02,51.05 v34.04,52.07 | 33.02,49.4 32,50.42 32,66.93 33.27,68.2 33.27,73.91 v32.51,74.68
D5  (via drill 0.41)  (1 unrouted)
  Top 0.254: U1.14 30.69,20.61 31.24,20.07 v31.75,20.07 | U2.14 30.69,49.06 30.99,48.77 v31.75,48.77 | U3.14 30.69,71.42 31.11,70.99 v31.75,70.99 | 30.91,36.14 v31.24,35.81
  Bottom 0.254: v31.75,20.07 31.75,20.19 30.99,20.95 30.99,29.59 31.75,30.35 31.75,31.37 30.99,32.13 30.99,35.56 v31.24,35.81 31.5,36.07 31.5,37.72 30.99,38.23 30.99,45.09 31.75,45.85 v31.75,48.77 30.99,49.53 30.99,67.69 31.75,68.45 v31.75,70.99
D6  (via drill 0.41)  (1 unrouted)
  Top 0.254: U1.17 28.74,20.53 28.96,20.32 29.72,20.32 v30.23,19.81 | U2.17 28.74,49.36 28.96,49.15 29.46,49.15 v30.23,48.39 | U3.17 28.74,71.59 29.72,70.61 v30.23,70.61 | 30.07,36.93 v30.23,37.08
  Bottom 0.254: v30.23,19.81 29.97,20.07 29.97,30.35 30.23,30.61 30.23,31.37 29.97,31.62 29.97,36.83 v30.23,37.08 29.97,37.34 29.97,45.59 30.23,45.85 v30.23,48.39 29.97,48.64 29.97,68.2 30.23,68.45 v30.23,70.61
D7  (via drill 0.41)  (1 unrouted)
  Top 0.254: U1.18 28.09,20.17 v28.7,19.56 | U2.18 28.09,49 v28.7,48.39 | U3.18 28.09,70.84 v28.19,70.74 | 28.6,37.74 v28.7,37.85
  Bottom 0.254: v28.7,19.56 28.96,19.81 28.96,30.35 28.7,30.61 v28.7,37.85 28.96,38.1 28.96,45.59 28.7,45.85 v28.7,48.39 28.96,48.64 28.96,68.2 28.7,68.45 28.7,70.23 v28.19,70.74
EN
  Top 0.406: 6.42,13.27 U8.4 5.76,13.38 5.48,13.1 R6.1
GND  (via drill 0.41)
  Top 0.406: 15.75,42.55 17.02,42.55 | U4.28 23.01,42.39 22.61,42.8 22.61,43.29 | CN1.5-G 21.62,5.11 22.1,5.59 v22.61,5.59
  Top 0.61: Z2.1 22.26,9.06 v23.37,10.16
  Top 1.016: H1.1 36.58,2.54 | H2.1 36.58,30.48 | H3.1 36.32,58.42 | H5.2 7.11,43.18 | H5.8 6.6,27.94 | H4.3 6.35,68.58 | H4.6 6.35,60.96 | 6.1,8.89 10.92,8.89 | H5.9 6.86,25.4 | H5.3 7.11,40.64
  Bottom 1.016: H1.1 36.83,2.54 | H2.1 36.83,30.48 | H3.1 36.83,58.42 | 6.35,68.58 H4.3 | 6.35,60.96 H4.6 | 6.35,43.18 H5.2 | 6.35,27.94 H5.8 | 6.86,25.4 H5.9 | 6.35,40.64 H5.3
  other vias: 13.72,42.16 34.04,15.75 6.48,14.73 19.56,11.68 24.26,70.23 21.34,66.55 24.38,59.05 24.13,51.82 21.08,55.37 21.08,51.56 24.89,48.77 28.7,75.44 22.86,76.2 17.78,81.53 17.65,72.9 11.68,68.83 9.91,73.66 9.65,63.5 11.43,53.85 12.19,48.77 8.89,41.91 8.89,39.37 8.89,36.83 8.89,34.29 8.89,31.75 8.89,29.21 16.26,29.72 22.1,28.96 25.15,28.7 20.57,22.61 19.56,20.57 11.94,21.59 5.08,14.48 29.97,12.32 30.23,8.38 34.54,44.45 34.8,41.91 34.8,39.37 34.04,37.08 36.2,27.56 34.8,55.88 34.8,59.69 34.29,67.31 34.29,69.85 34.29,72.39 34.8,77.47 34.54,80.01 34.54,74.93 8.13,64.77 18.03,68.07 14.48,80.01 34.8,46.99 34.54,49.53 21.59,13.21 21.59,19.81 34.8,11.43 34.04,13.46 21.97,45.85 9.02,6.99 24.64,81.92 8.38,81.92 1.91,75.82 21.46,69.34 16.64,38.73 16.89,41.15 24.38,56.39 24.26,62.99 24.26,65.53 19.05,26.16 16.51,26.42 18.03,5.71 8.38,18.29 19.56,16.76 19.56,18.8 14.48,21.59 17.27,22.1 4.32,20.83 5.59,9.65 7.62,6.99 4.32,8.64 9.4,21.34 24.38,5.59 19.56,8.64 5.59,8.38 8.23,14.71 12.06,6.99 10.92,16.26 10.67,18.29 14.73,18.8 14.99,3.3 27.43,10.41 34.29,3.81 25.4,26.29 34.16,29.34 36.7,34.42 22.86,82.17 17.78,55.88 17.53,59.69 34.04,20.57 34.42,8.89 13.97,64.01 11.43,58.93 11.68,24.38 25.65,75.44 36.7,62.36 5.59,48.26 20.45,37.47 20.45,40.01 21.72,34.67 13.72,29.46 12.83,10.03 12.83,8.51 15.75,46.86 23.24,39.75 25.15,34.8 13.72,32.26
  pour Top (isolate 0.229, rank 2): -2.54,21.34 -2.54,-2.29 45.97,-2.29 45.97,86.36 -2.54,86.36 -2.54,75.18 -6.35,75.18 -6.35,21.34
  pour Bottom (isolate 0.229, rank 2): -2.54,86.36 -2.54,-2.54 44.45,-2.54 44.45,86.36
ILIM
  Top 0.356: U7.4 14.86,24.39 R9.2
LE0  (via drill 0.41)
  Top 0.254: U4.12 22.2,32.16 24.13,30.23 25.65,30.23 v26.42,29.46 | U1.11 32.64,19.43 32,18.8 27.69,18.8 v26.42,20.07
  Bottom 0.254: v26.42,20.07 27.43,21.08 27.43,28.45 v26.42,29.46
LE1
  Top 0.254: U2.11 32.64,48.14 32,47.5 28.57,47.5 28.32,47.75 27.18,47.75 26.16,46.74 26.16,43.69 28.7,41.15 28.7,39.12 28.12,38.53 U4.22
LE2  (via drill 0.41)
  Top 0.254: U3.11 32.64,70.74 31.75,69.85 v26.42,69.85 | v27.18,41.4 27.94,40.64 27.94,39.62 27.66,39.34 U4.23
  Bottom 0.254: v26.42,69.85 26.42,63.88 27.43,62.87 27.43,49.78 26.92,49.28 26.92,47.88 26.67,47.62 26.67,46.86 26.42,46.61 26.42,45.72 27.18,44.96 v27.18,41.4
MIDI-IN-4
  Top 0.406: H4.1 8.13,73.66 9.4,74.93 R18.1
MIDI-IN-5
  Top 0.406: H4.2 9.91,71.12 | 9.91,71.12 14.22,75.44 14.22,78.49 13.72,78.99 U5.2 | 9.91,71.12 12.07,71.12 D4.A
MIDI-OUT-4
  Top 0.406: H4.4 8.38,66.04 9.4,67.06 R14.1
MIDI-OUT-5
  Top 0.406: H4.5 8.13,63.5 9.91,65.28 R15.1
MIDI-RX  (via drill 0.41)  (1 unrouted)
  Top 0.406: R10.2 21.34,73.41 v20.57,74.17 20.57,76.39 U5.4 | 19.81,34.54 20.07,34.8 v20.07,35.56 | U6.2 20.07,65.28 v19.56,65.79 | U4.8 18.03,34.54
  Bottom 0.406: v20.57,74.17 20.57,72.64 19.56,71.63 v19.56,65.79 19.56,36.07 v20.07,35.56
MIDI-THRU-4
  Top 0.406: H4.7 6.6,58.42 10.67,62.48 R16.1
MIDI-THRU-5
  Top 0.406: H4.8 6.86,55.88 11.68,60.71 R17.1
MIDI-TX  (via drill 0.41)  (1 unrouted)
  Top 0.406: 17.73,33.22 v17.27,32.77 | R15.2 14.22,65.28 v15.49,64.01
  Bottom 0.406: v17.27,32.77 18.8,34.29 18.8,60.71 v15.49,64.01
N$1
  Top 0.254: U1.19 27.44,22.62 30.23,25.4 H1.10
N$2
  Top 0.254: U1.16 29.39,23.3 30.99,24.89 35.05,24.89 37.08,22.86 H1.9
N$3
  Top 0.254: U1.15 30.04,22.93 31.5,24.38 34.54,24.38 35.56,23.37 35.56,22.1 37.34,20.32 H1.8
N$4
  Top 0.254: U1.12 31.99,22.59 32.26,22.86 33.02,22.86 37.08,18.8 37.08,18.03 37.34,17.78 H1.7
N$5
  Top 0.254: U1.9 31.99,15 32.26,14.73 36.07,14.73 36.58,15.24 H1.6
N$6
  Top 0.254: U1.6 30.04,14.91 30.73,14.22 35.81,14.22 37.34,12.7 H1.5
N$7
  Top 0.254: U1.5 29.39,14.55 30.23,13.72 32.26,13.72 33.78,12.19 35.31,12.19 37.34,10.16 H1.4
N$8
  Top 0.254: U1.2 27.44,14.97 29.21,13.21 31.75,13.21 37.34,7.62 H1.3
N$9
  Top 0.254: U2.2 27.44,43.68 29.46,41.66 31.24,41.66 37.34,35.56 H2.3
N$10
  Top 0.254: U2.5 29.39,43.25 30.48,42.16 33.27,42.16 37.34,38.1 H2.4
N$11
  Top 0.254: U2.6 30.04,43.36 30.73,42.67 35.56,42.67 37.59,40.64 H2.5
N$12
  Top 0.254: U2.9 31.99,43.7 32.51,43.18 H2.6
N$13
  Top 0.254: H2.7 34.8,45.72 33.53,46.99 33.53,51.31 33.27,51.56 32.26,51.56 31.99,51.3 U2.12
N$14
  Top 0.254: H2.8 36.83,48.26 35.31,49.78 35.31,52.2 34.67,52.83 30.99,52.83 30.04,51.89 U2.15
N$15
  Top 0.254: H2.9 37.08,50.8 36.07,51.82 36.07,52.32 35.05,53.34 30.73,53.34 29.39,52 U2.16
N$16
  Top 0.254: H2.10 36.58,53.34 36.07,53.85 29.97,53.85 27.44,51.32 U2.19
N$17
  Top 0.254: U3.16 29.39,73.84 32,76.45 35.05,76.45 37.34,78.74 H3.9
N$18
  Top 0.254: U3.19 27.44,73.92 27.94,74.42 29.21,74.42 32,77.22 33.27,77.22 37.34,81.28 H3.10
N$19
  Top 0.254: U3.15 30.04,73.73 32,75.69 36.83,75.69 37.34,76.2 H3.8
N$20
  Top 0.254: U3.12 31.99,73.65 32.26,73.91 37.08,73.91 37.34,73.66 H3.7
N$21
  Top 0.254: U3.9 31.99,66.05 32.26,65.79 34.54,65.79 35.05,66.29 35.05,69.34 36.83,71.12 H3.6
N$22
  Top 0.254: U3.6 30.04,65.97 30.73,65.28 35.05,65.28 36.58,66.8 36.58,67.82 37.34,68.58 H3.5
N$23
  Top 0.254: U3.5 29.39,65.6 30.23,64.77 35.81,64.77 37.08,66.04 H3.4
N$24
  Top 0.254: U3.2 27.44,66.03 29.97,63.5 H3.3
N$25
  Top 0.406: R18.2 9.4,80.52 10.41,81.53 U5.1 15.24,81.53 16.12,80.65 D4.C
N$26
  Top 0.254: LED.A1 17.24,53.88 16.76,54.36 12.95,54.36 11.94,55.37 11.94,58.17 12.45,58.67 R12.1
N$27
  Top 0.254: R13.1 13.32,55.51 13.72,55.12 17.27,55.12 18.8,53.59 18.8,51.82 18.35,51.37 LED.A2
N$28
  Top 1.016: F2.2 2.29,21.34 H5.10
N$30
  Top 0.406: CN1.1-5V 19.02,6.32
  Top 0.61: 19.02,6.32 20.07,7.37 | 20.07,7.37 20.83,8.13 20.83,9.14 22.61,10.92 F1.2 | C8.1 15.3,5.4 17.27,7.37 20.07,7.37
N$33
  Top 0.406: R17.2 18.18,60.71 U6.4
OE  (via drill 0.41)
  Top 0.254: U1.1 26.79,17.65 v27.18,18.03 | U2.1 26.79,45.84 v27.18,46.23 | U3.1 26.79,64.65 v27.18,64.26 R3.2 | U4.13 23.01,32.11 24.38,30.73 26.67,30.73 v27.18,30.23
  Bottom 0.254: v27.18,64.26 27.94,63.5 27.94,49.53 27.43,49.02 27.43,47.62 27.18,47.37 v27.18,46.23 27.18,45.85 27.94,45.09 27.94,38.99 27.43,38.48 27.43,31.62 27.18,31.37 v27.18,30.23 27.56,30.23 27.94,29.84 27.94,20.7 27.18,19.94 v27.18,18.03
RESET  (via drill 0.41)
  Top 0.254: U4.24 26.72,40.59 26.42,40.89 v26.42,42.29 | R5.2 25.65,55.63 v25.91,55.37 26.41,54.87 D5.A
  Bottom 0.254: v26.42,42.29 26.42,44.96 25.91,45.47 25.91,46.99 26.16,47.24 26.16,48.01 26.42,48.26 26.42,49.53 26.92,50.04 26.92,54.36 v25.91,55.37 DOCK-RESET.P$1
STAT  (via drill 0.41)
  Top 0.254: U4.11 21.41,31.57 v21.34,31.5 | v14.99,29.46 14.99,28.28 U7.1
  Bottom 0.254: v21.34,31.5 21.34,31.24 20.83,30.73 15.75,30.73 14.99,29.97 v14.99,29.46
STBY-LED  (via drill 0.41)
  Top 0.254: v23.62,48.26 23.62,47.75 25.15,46.23 25.15,42.8 25.4,42.55 U4.25 | v21.59,50.29 20.95,50.29 20.45,49.78 13.97,49.78 v13.72,50.04 13.72,51.34 LED.C2
  Bottom 0.254: v23.62,48.26 v21.59,50.29 | H4.10 12.95,50.8 v13.72,50.04
SW0  (via drill 0.41)
  Top 0.254: U4.10 20.6,32.28 v20.07,31.75
  Bottom 0.254: v20.07,31.75 19.56,31.24 10.92,31.24 10.16,30.48 H5.7
SW1  (via drill 0.41)
  Top 0.254: U4.7 17.04,35.33 16.51,34.8 v15.24,34.8
  Bottom 0.254: v15.24,34.8 12.19,34.8 10.41,33.02 H5.6
SW2  (via drill 0.41)
  Top 0.254: U4.6 17.09,36.14 16.51,35.56 v14.22,35.56
  Bottom 0.254: v14.22,35.56 H5.5
SW3  (via drill 0.41)
  Top 0.254: U4.5 17.12,36.93 16.51,36.32 v15.24,36.32
  Bottom 0.254: v15.24,36.32 12.19,36.32 10.41,38.1 H5.4
UCAP
  Top 0.406: U4.27 23.8,43.4 C7.1
USB-D+
  Top 0.406: CN1.3-D+ 20.32,5.08 21.84,6.6 25.15,6.6 25.91,7.37 25.91,8.13 | 25.91,8.13 R8.1 | Z1.2 26.42,8.64 25.91,8.13
USB-D+R  (via drill 0.41)
  Top 0.406: U4.29 22.2,37.49 v24.13,35.56 | R8.2 25.91,12.95 v25.15,13.72
  Bottom 0.406: v25.15,13.72 24.13,14.73 v24.13,35.56
USB-D-
  Top 0.406: CN1.2-D- 19.67,5.48 21.56,7.37 24.89,7.37 25.15,7.62 25.15,8.13 | 25.15,8.13 25.15,9.4 24.64,9.91 R7.1 | Z2.2 24.64,8.64 25.15,8.13
USB-D-R  (via drill 0.41)
  Top 0.406: U4.30 21.41,37.26 23.11,35.56 v23.11,35.05 | R7.2 24.64,12.95 v23.88,13.72
  Bottom 0.406: v23.88,13.72 23.37,14.22 23.37,34.8 v23.11,35.05
USBVCC  (1 unrouted)
  Top 0.406: U7.6 21.66,26.85 21.91,26.6 | C19.1 22.61,24.38
  Top 0.61: 21.91,26.6 22.61,25.91 22.61,24.38
VBOOST
  Top 0.406: U8.1 9.21,16.08 9.47,15.82 | 9.47,15.82 C3.1 | 9.47,15.82 9.47,19.49
  Top 0.66: 9.47,19.49 9.47,19.75 D3.C
VFB
  Top 0.406: 6.35,16.14 U8.3 6.35,16.15 | C4.2 R1.2 R2.1
  Top 0.508: R2.1 5.7,16.8 U8.3
VIN-RECT  (2 unrouted)
  Top 0.508: 4.75,11.8 4.57,11.62
  Top 0.61: U8.5 C1.1
  Top 1.016: C1.1 4.57,11.62 D2.C 2.29,11.87 F2.1
VREG  (3 unrouted)
  Top 0.406: U7.8 19.52,28.15 | C4.1 R1.1
  Top 0.61: 19.52,28.15 17.89,26.53 C20.1 17.89,23.76 18.54,23.11 | R4.2 13.21,23.88 13.97,23.11 | 13.97,23.11 9.65,23.11 7,20.46 | 13.97,23.11 14.48,23.11 | 14.48,23.11 18.54,23.11 | 18.54,23.11 20.57,21.08 20.57,11.18 18.8,9.4 | 13.2,21.84 14.48,23.11 | L1.2 18.39,11.02 17.78,10.41 17.78,9.46 C2.1
VSNS
  Top 0.406: U7.3 14.01,26.85 | 14.01,26.85 R4.1 | R11.2 13.14,26.85 14.01,26.85
VSW
  Top 0.61: C3.2 D1.C | C3.2 9.02,14.08 U8.6 | C3.2 11.69,14.08 L1.1
  pour Top (no thermals): 8.51,12.83 8.64,12.7 8.64,12.32 11.18,12.32 11.18,13.21 11.43,13.46 11.43,14.61 10.79,13.97 9.14,13.97 8.51,13.34
XTAL1
  Top 0.254: U4.1 18.49,42.23 C5.1 18.29,42.43 18.29,44.96 17.77,45.48 17.02,45.48 Y1.1
XTAL2
  Top 0.254: U4.2 17.42,39.34 16.51,40.26 15.73,40.26 C6.1 15.61,40.39 14.86,40.39 14.67,40.57 14.67,43.73 Y1.3

### Text on the board
tPlace: 23 | 22 | 21 | 4 | MIDI | 20 | IN | 5 | 19 | 2 | 18 | 4 | OUT | 17 | 5 | OUT | 16 | 2 | 5V | 4 | THRU | GND | 5 | ACT | OUT | 15 | STBY | 14 | 13 | 5V | 12 | GND | 11 | GND | 10 | SW3 | 9 | SW2 | 8 | SW1 | 5V | SW0 | GND | GND | GND | OUT | 7 | VIN | 6 | 5 | 4 | 3 | 2 | 1 | 0 | 5V | GND | USB-MIDI
bPlace: 23 | 22 | 21 | 4 | MIDI | 20 | IN | 5 | 19 | 2 | 18 | 4 | OUT | 17 | 5 | OUT | 16 | 2 | 5V | 4 | THRU | GND | 5 | ACT | OUT | 15 | STBY | 14 | 13 | 5V | 12 | GND | 11 | GND | 10 | SW3 | 9 | SW2 | 8 | SW1 | 5V | SW0 | GND | GND | GND | OUT | 7 | VIN | 6 | 5 | 4 | 3 | 2 | 1 | 0 | MIDIWIDGET REV B | 5V | GND | MIDIWIDGET.COM